# EAGLE design psu-digital (EAGLE 6.4)
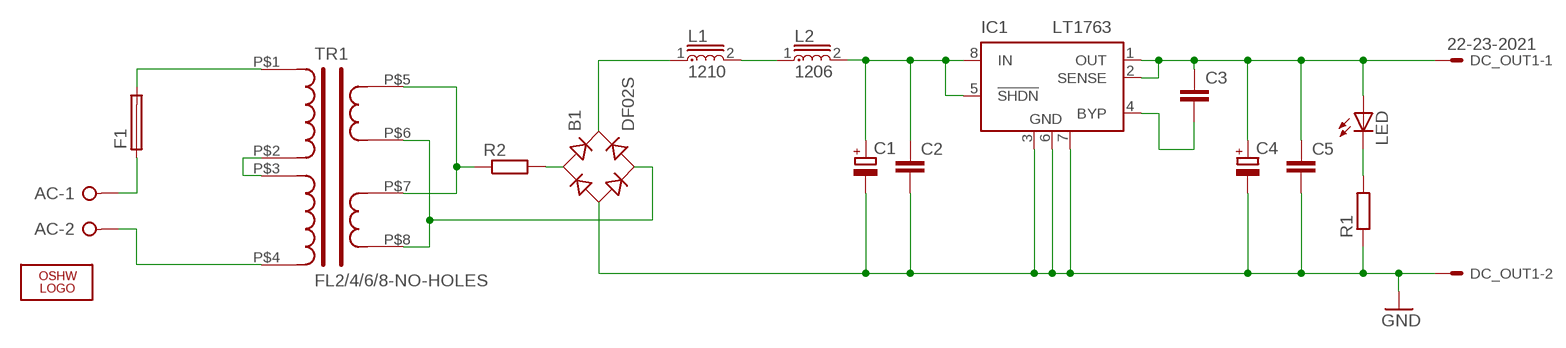
[diagram p0: schematic, sheet 1]

## Parts
AC  W237-02P  [W237-132]
B1  DF02S  [DFS]
C1  CPOL-EUE7.5-16  [E7,5-16]
C2  C-EUC1206  [C1206]
C3  C-EUC1206  [C1206]
C4  CPOL-EUD  [PANASONIC_D]
C5  C-EUC1206  [C1206]
DC_OUT1  22-23-2021  [22-23-2021]
F1  GSH15  [GSH15]
IC1  LT1763  LT1763CS8-3.3  [SOIC8]
L1  1210  [1210]
L2  1206  [1206]
LED  LEDCHIPLED_1206  [CHIPLED_1206]
LOGO1  OSHW_LOGO_FILLX0200-NT  [OSHW_FILLX200_NOTEXT]
R1  R-EU_R1206  [R1206]
R2  R-EU_R1210  [R1210]
TR1  FL2/4/6/8-NO-HOLES  [FL2/4/6/8-NO-HOLES]

## Nets
GND: B1.- C1.- C2.2 C4.- C5.2 DC_OUT1.2 IC1.3(GND) IC1.6(GND) IC1.7(GND) R1.1
N$1: TR1.P$2(PRI1B) TR1.P$3(PRI2A)
N$2: F1.2 TR1.P$1(PRI1A)
N$3: AC.2 TR1.P$4(PRI2B)
N$4: AC.1 F1.1
N$5: R2.1 TR1.P$5(SEC1A) TR1.P$7(SEC2A)
N$6: B1.AC1 R2.2
N$7: C3.2 IC1.4(BYP)
N$8: LED.C R1.2
N$9: B1.+ L1.1
N$10: C3.1 C4.+ C5.1 DC_OUT1.1 IC1.1(OUT) IC1.2(SENSE) LED.A
N$11: L1.2 L2.1
N$12: B1.AC2 TR1.P$6(SEC1B) TR1.P$8(SEC2B)
N$18: C1.+ C2.1 IC1.5(!SHDN) IC1.8(IN) L2.2

## Library data of the parts
AC = con-wago-508:W237-02P: WAGO SREW CLAMP; OC_FARNELL: unknown; OC_NEWARK: unknown
B1 = rectifier:DF*S: Surface Mount Glass Passivated Bridge Rectifiers Source: Source: Comchip Bridge Rectifiers DF005S-G thru DF10S-G.pdf
C1 C4 = rcl:CPOL-EU: POLARIZED CAPACITOR, European symbol
C2 C3 C5 = rcl:C-EU: CAPACITOR, European symbol
DC_OUT1 = con-molex:22-23-2021: .100" (2.54mm) Center Header - 2 Pin; MF: MOLEX; MPN: 22-23-2021; OC_FARNELL: 1462926; OC_NEWARK: 25C3832
F1 = fuse:GSH15: FUSE HOLDER grid 15mm, 19649 Wickmann; MPN: 64900001039; OC_FARNELL: 1271673; OC_NEWARK: 02P0318
IC1 = linear-technology:LT1763CS8: 500mA, Low Noise, LDO Micropower Regulators Source: http://cds.linear.com/docs/Datasheet/1763ff.pdf; MPN: LT1763CS8-3.3; OC_FARNELL: 1273617; OC_NEWARK: 57M6055
L1 = inductors:1210
L2 = inductors:1206
LED = led:LED: LED OSRAM: - CHIPLED LG R971, LG N971, LY N971, LG Q971, LY Q971, LO R971, LY R971 LH N974, LH R974 LS Q976, LO Q976, LY Q976 LO Q996 - Hyper CHIPLED LW Q18S LB Q993, LB Q99A, LB R99A - SideLED LS A670, LO A670, LY A670, LG A670, LP A670 LB A673, LV A673, LT A673, LW A673 LH A674 LY A675 LS A676, LA A676, LO A676, LY A676, LW A676 LS A679, LY A679, LG A679 - Hyper Micro SIDELED® LS Y876, LA Y876, LO Y876, LY Y876 LT Y87S - SmartLED LW L88C, LW L88S LB L89C, LB L89S, LG L890 LS L89K, LO L89K, LY L89K LS L896, LA L896, LO L896, LY L896 - TOPLED LS T670, LO T670, LY T670, LG T670, LP T670 LSG T670, LSP T670, LSY T670, LOP T670, LYG T670 LG T671, LOG T671, LSG T671 LB T673, LV T673, LT T673, LW T673 LH T674 LS T676, LA T676, LO T676, LY T676, LB T676, LH T676, LSB T676, LW T676 LB T67C, LV T67C, LT T67C, LS T67K, LO T67K, LY T67K, LW E67C LS E67B, LA E67B, LO E67B, LY E67B, LB E67C, LV E67C, LT E67C LW T67C LS T679, LY T679, LG T679 LS T770, LO T770, LY T770, LG T770, LP T770 LB T773, LV T773, LT T773, LW T773 LH T774 LS E675, LA E675, LY E675, LS T675 LS T776, LA T776, LO T776, LY T776, LB T776 LHGB T686 LT T68C, LB T68C - Hyper Mini TOPLED® LB M676 - Mini TOPLED Santana® LG M470 LS M47K, LO M47K, LY M47K Source: http://www.osram.convergy.de LUXEON: - LUMILED® LXK2-PW12-R00, LXK2-PW12-S00, LXK2-PW14-U00, LXK2-PW14-V00 LXK2-PM12-R00, LXK2-PM12-S00, LXK2-PM14-U00 LXK2-PE12-Q00, LXK2-PE12-R00, LXK2-PE12-S00, LXK2-PE14-T00, LXK2-PE14-U00 LXK2-PB12-K00, LXK2-PB12-L00, LXK2-PB12-M00, LXK2-PB14-N00, LXK2-PB14-P00, LXK2-PB14-Q00 LXK2-PR12-L00, LXK2-PR12-M00, LXK2-PR14-Q00, LXK2-PR14-R00 LXK2-PD12-Q00, LXK2-PD12-R00, LXK2-PD12-S00 LXK2-PH12-R00, LXK2-PH12-S00 LXK2-PL12-P00, LXK2-PL12-Q00, LXK2-PL12-R00 Source: www.luxeon.com KINGBRIGHT: KA-3528ASYC Source: www.kingbright.com
LOGO1 = ohw-logo:OSHW_LOGO_FILL
R1 R2 = rcl:R-EU_: RESISTOR, European symbol
TR1 = trafo-block:FL2/4/6/8-NO-HOLES

## Board
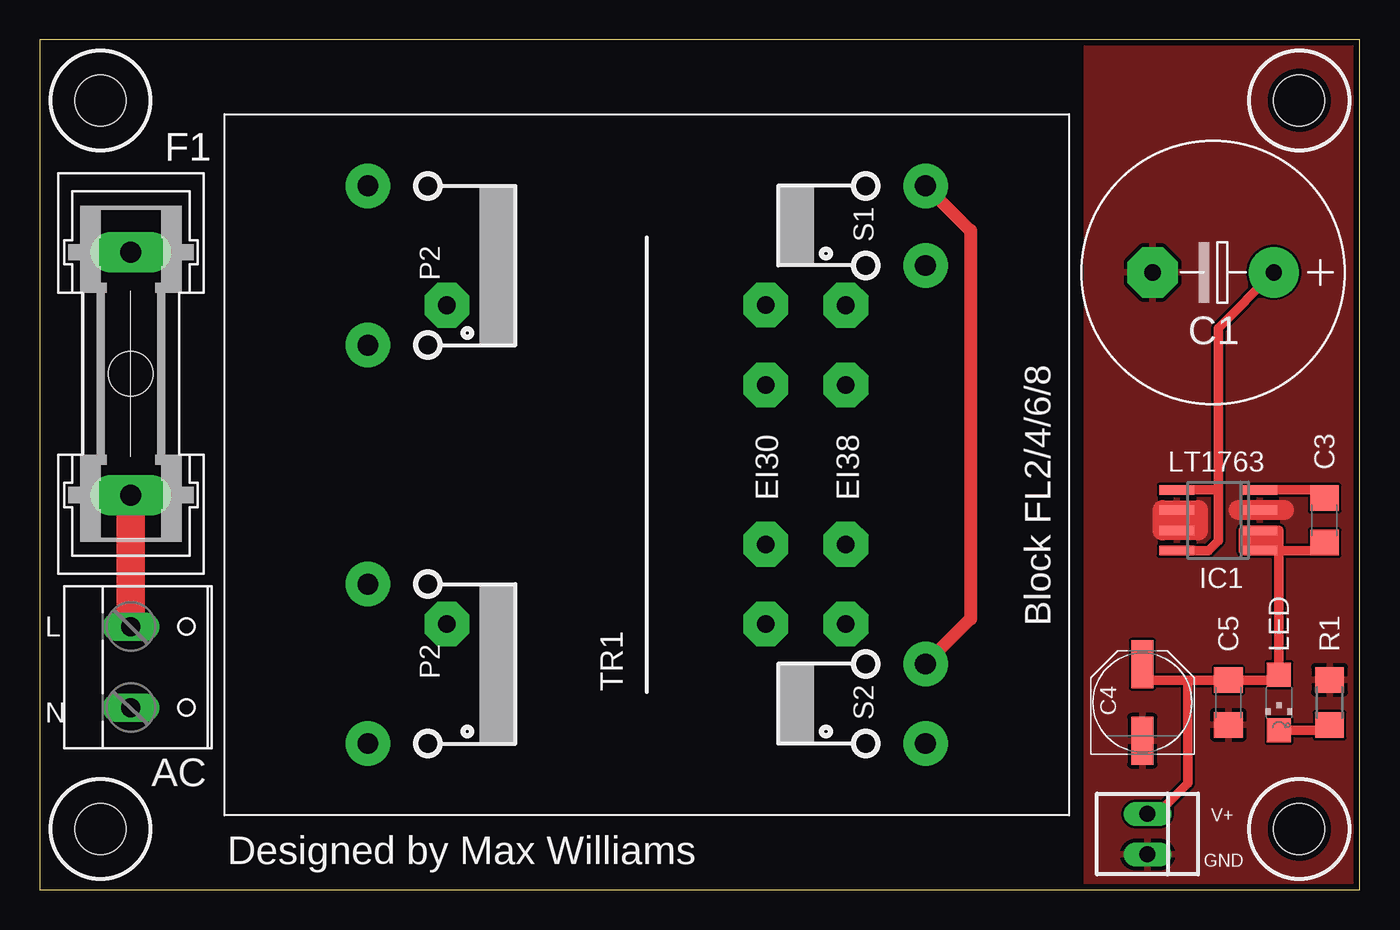
[diagram p1: board, top side]
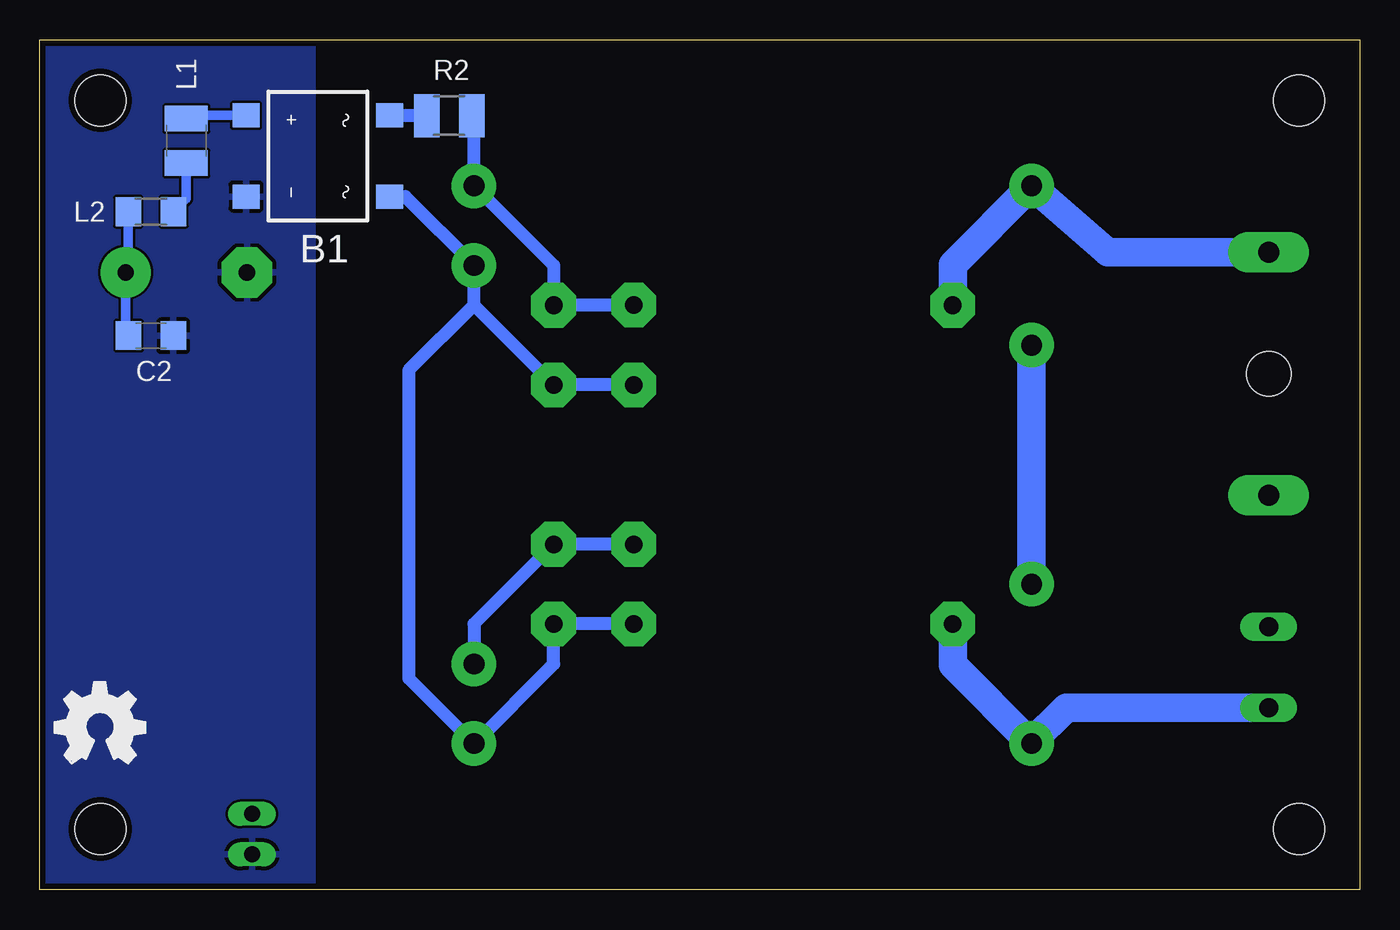
[diagram p2: board, bottom side, seen from below]

Size 82.86 x 53.33 mm. Coordinates in mm from the lower left corner, seen from the top.
Outline: 0,0 82.86,0 82.86,53.33 0,53.33 0,0
Copper layers (1*16): Top 0.0356mm / dielectric 1.5011mm / Bottom 0.0356mm
Design rules "LaenPCBOrder": minimum track width 6mil, minimum drill 13mil, track to track 6mil, track to pad 6mil, pad to pad 6mil, via to via 6mil, smd to smd 6mil, copper to edge 15mil, drill to drill 6mil, minimum pad ring 7mil, minimum via ring 7mil, stop-mask expansion 3mil, vias tented up to drill 0mil, thermal gap 10mil
Holes 3.2 mm at 3.81,49.53 3.81,3.81 79.06,3.81 79.06,49.53

### Footprints (pad centres in the part's own frame; a part is rotated, then mirrored left to right if it is on the bottom)
W237-132 = drill 1.194 long: 1 -2.54,-0.635; 2 2.54,-0.635
DFS = smd 1.5 x 1.7: + -2.55,-4.5; - 2.55,-4.5; AC1 -2.55,4.5; AC2 2.55,4.5
E7,5-16 = drill 1.016 pad 3.15: + -3.81,0 | drill 1.016 pad 3.15 octagon: - 3.81,0
C1206 = smd 1.6 x 1.8: 1 -1.4,0; 2 1.4,0
PANASONIC_D = smd 3 x 1.4: + 2.4,0; - -2.4,0
22-23-2021 = drill 1 long: 1 -1.27,0; 2 1.27,0
GSH15 = drill 1.321 pad 2.54 long: 1 -7.62,0; 2 7.62,0 | hole 2.794: 0,0
SOIC8 = smd 0.6 x 2.2: 1 -1.905,-2.6; 2 -0.635,-2.6; 3 0.635,-2.6; 4 1.905,-2.6; 5 1.905,2.6; 6 0.635,2.6; 7 -0.635,2.6; 8 -1.905,2.6
1210 = smd 1.6 x 2.7: 1 -1.4,0; 2 1.4,0
1206 = smd 1.6 x 1.803: 1 -1.422,0; 2 1.422,0
CHIPLED_1206 = smd 1.5 x 1.5: A 0,-1.75; C 0,1.75
R1206 = smd 1.6 x 1.803: 1 -1.422,0; 2 1.422,0
R1210 = smd 1.6 x 2.7: 1 -1.4,0; 2 1.4,0
FL2/4/6/8-NO-HOLES = drill 1.3 pad 2.794: P$1 -17.5,17.5; P$2 -17.5,7.5; P$3 -17.5,-7.5; P$4 -17.5,-17.5; P$5 17.5,17.5; P$6 17.5,12.5; P$7 17.5,-12.5; P$8 17.5,-17.5

### Placement (x,y rotation side)
AC  6.35,13.97 270 top
B1  65.41,46.04 270 bottom
C1  73.66,38.73 180 top
C2  75.88,34.77 0 bottom
C3  80.64,23.18 90 top
C4  69.22,11.75 90 top
C5  74.61,11.75 270 top
DC_OUT1  69.53,3.49 270 top
F1  5.71,32.38 90 top
IC1  73.98,23.18 90 top
L1  73.66,46.99 270 bottom
L2  75.88,42.55 180 bottom
LED  77.79,11.75 180 top
LOGO1  81.92,7.94 0 bottom
R1  80.96,11.75 270 top
R2  57.15,48.58 180 bottom
TR1  38.1,26.67 0 top

### Tracks (layer width: path | path; a pad name or v marks a point on that pad's centre or on a via)
GND
  Top 1.27: 78.11,23.81 75.25,23.81 | 72.71,22.54 70.48,22.54 70.48,23.81 72.71,23.81 72.71,22.54
  pour Bottom: 65.72,53.02 82.55,53.02 82.55,0.32 65.72,0.32
  pour Top: 65.72,53.02 82.55,53.02 82.55,0.32 65.72,0.32
N$1
  Bottom 1.778: TR1.P$3 TR1.P$2
N$2  (via drill 1.1 pad 2.81)
  Bottom 1.778: F1.2 15.8,40.01 TR1.P$1 25.55,39.22 v25.55,36.67
N$3  (via drill 1.1 pad 2.81)
  Bottom 0.61: TR1.P$4 20.64,9.21
  Bottom 1.778: 20.64,9.21 18.41,11.43 AC.2 | v25.55,16.68 25.55,14.12 TR1.P$4
N$4
  Top 1.778: AC.1 F1.1
N$5  (via drill 1.1 pad 2.8, 1.1 pad 2.81)
  Top 0.813: TR1.P$5 58.42,41.35 58.42,16.99 TR1.P$7
  Bottom 0.813: v45.56,36.69 45.58,36.67 v50.6,36.67 50.6,39.17 TR1.P$5 55.6,48.43 R2.1 | v45.58,21.68 v50.6,21.68 55.6,16.68 TR1.P$7
N$6
  Bottom 0.813: R2.2 60.9,48.58 B1.AC1
N$7
  Top 0.61: IC1.4 80.14,25.08 C3.2
N$8
  Top 0.61: LED.C 80.64,10 R1.2
N$9
  Bottom 0.61: B1.+ 73.46,48.59 L1.1
N$10
  Top 0.61: 75.88,21.27 IC1.1 | 75.56,22.23 75.56,21.91 | 75.56,21.59 75.56,21.27 IC1.1 | 77.79,21.27 77.79,22.54 IC1.2 75.56,22.54 75.56,22.23 | 75.56,22.23 77.47,22.23 77.47,21.91 75.56,21.91 | 75.56,21.91 75.56,21.59 | 75.56,21.59 77.47,21.59 | 77.79,21.27 IC1.1 | 72.07,13.15 C5.1 77.44,13.15 LED.A 77.79,21.27 | 72.07,13.15 69.4,13.15 69.22,13.34 C4.+ | 77.79,21.27 80.14,21.27 C3.1 | DC_OUT1.1 70.17,4.76 72.07,6.67 72.07,13.15
N$11
  Bottom 0.61: L1.2 73.66,43.35 L2.1
N$12  (via drill 1.1 pad 2.81)
  Bottom 0.813: v45.58,31.68 v50.6,31.68 55.6,36.67 | 55.6,36.67 TR1.P$6 59.92,43.49 B1.AC2 | v45.58,16.68 v50.6,16.68 50.6,14.17 TR1.P$8 59.69,13.26 59.69,32.59 55.6,36.67
N$18
  Top 0.61: IC1.8 73.34,21.27 73.98,21.91 73.98,25.08 | 73.98,25.08 73.98,35.24 C1.+ | IC1.5 73.98,25.08
  Bottom 0.61: L2.2 77.31,38.9 C1.+ 77.47,34.95 C2.1

### Text on the board
tPlace: V+ | GND
tNames: EI30 | EI38 | L | N | Designed by Max Williams